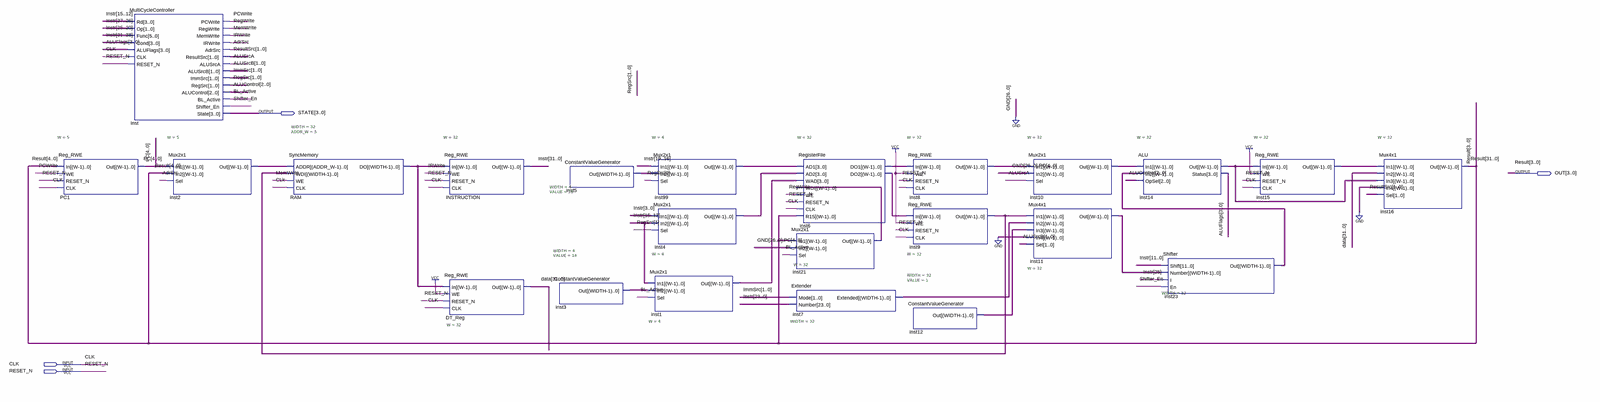
[diagram p0: schematic sheet, whole]
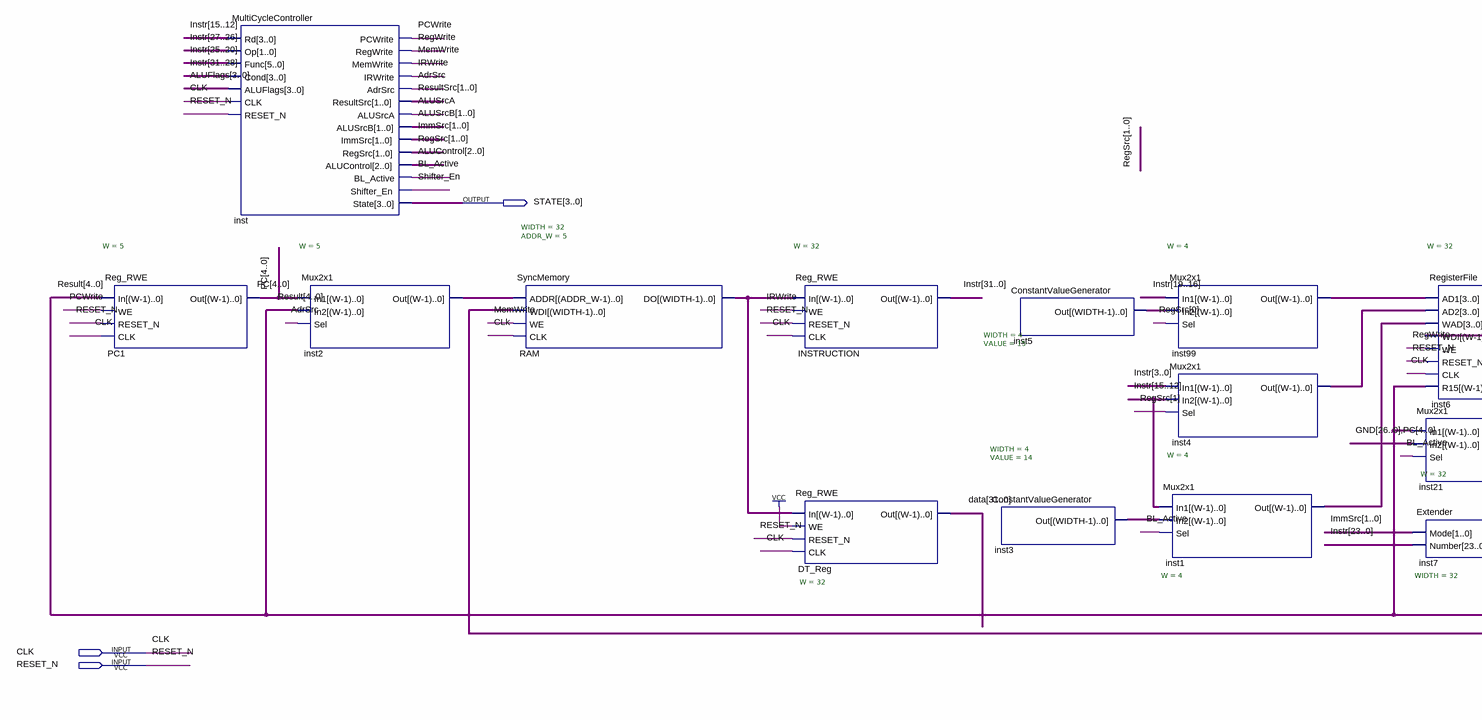
[diagram p1: schematic sheet, left part]
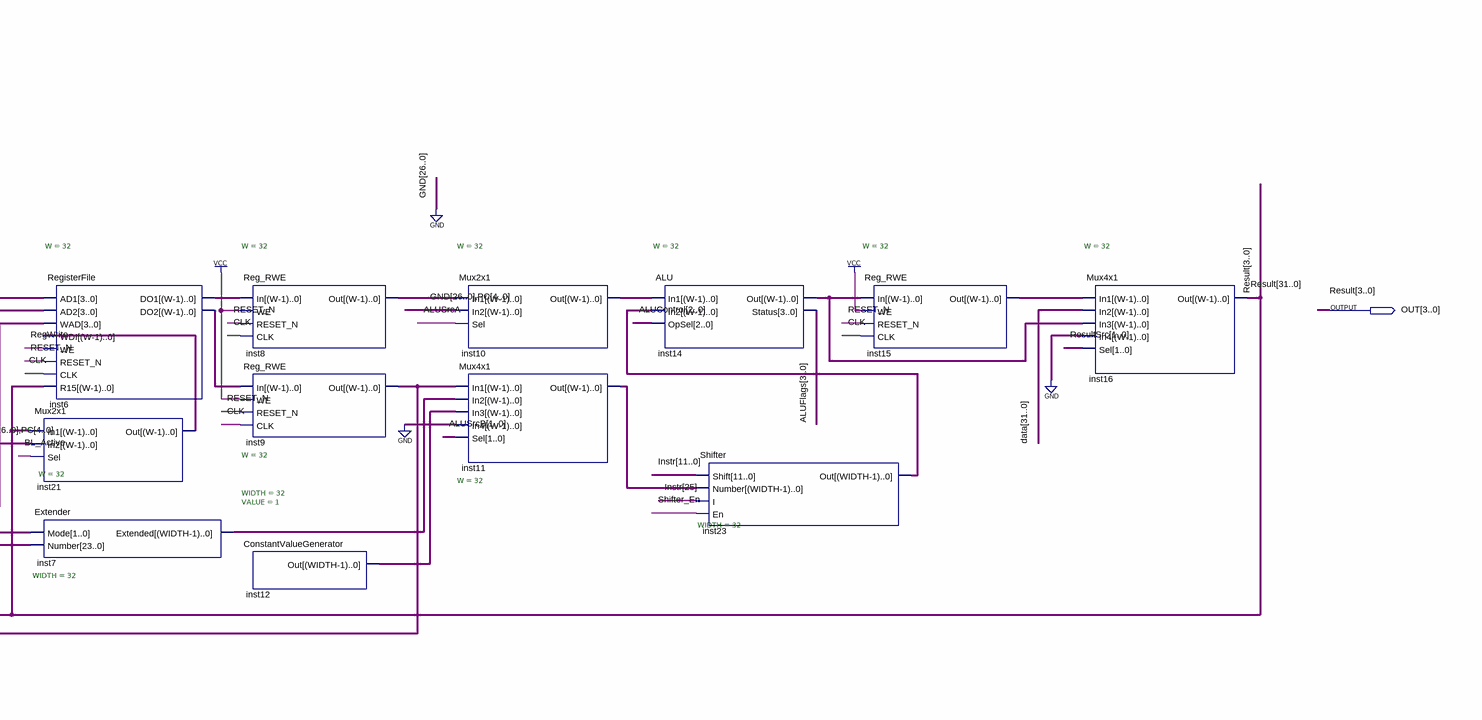
[diagram p2: schematic sheet, right part]
// Quartus schematic MultiCycle.bdf as structural Verilog: 23 symbols, 4 pins
module MultiCycle (
  input  CLK,
  input  RESET_N,
  output [3:0] STATE,
  output [3:0] OUT
);

  wire AdrSrc, ALUSrcA, BL_Active, IRWrite, MemWrite, PCWrite, RegWrite, Shifter_En;
  wire [1:0] ALUSrcB, ImmSrc, RegSrc, ResultSrc;
  wire [2:0] ALUControl;
  wire [3:0] ALUFlags, inst1_out, inst3_out, inst4_out, inst5_out, inst99_out;
  wire [4:0] inst2_out, PC;
  wire [31:0] data, inst6_do1, inst6_do2, inst7_extended, inst8_out, inst9_out, inst10_out, inst11_out,
       inst12_out, inst14_out, inst15_out, inst21_out, inst23_out, Instr, RAM_do;
  wire [31:4] Result;

  Reg_RWE #(.W(5)) PC1 (.In({Result[4], OUT}), .WE(PCWrite), .RESET_N(RESET_N), .CLK(CLK), .Out(PC));
  MultiCycleController inst (
    .Rd(Instr[15:12]), .Op(Instr[27:26]), .Func(Instr[25:20]), .Cond(Instr[31:28]), .ALUFlags(ALUFlags),
    .CLK(CLK), .RESET_N(RESET_N), .PCWrite(PCWrite), .RegWrite(RegWrite), .MemWrite(MemWrite),
    .IRWrite(IRWrite), .AdrSrc(AdrSrc), .ResultSrc(ResultSrc), .ALUSrcA(ALUSrcA), .ALUSrcB(ALUSrcB),
    .ImmSrc(ImmSrc), .RegSrc(RegSrc), .ALUControl(ALUControl), .BL_Active(BL_Active),
    .Shifter_En(Shifter_En), .State(STATE));
  Mux2x1 #(.W(5)) inst2 (.In1(PC), .In2({Result[4], OUT}), .Sel(AdrSrc), .Out(inst2_out));
  SyncMemory #(.WIDTH(32), .ADDR_W(5)) RAM (.ADDR(inst2_out), .WDI(inst9_out), .WE(MemWrite), .CLK(CLK), .DO(RAM_do));
  Reg_RWE #(.W(32)) INSTRUCTION (.In(RAM_do), .WE(IRWrite), .RESET_N(RESET_N), .CLK(CLK), .Out(Instr));
  Reg_RWE #(.W(32)) DT_Reg (.In(RAM_do), .WE(1'b1), .RESET_N(RESET_N), .CLK(CLK), .Out(data));
  ConstantValueGenerator #(.WIDTH(4), .VALUE(14)) inst3 (.Out(inst3_out));
  ConstantValueGenerator #(.WIDTH(4), .VALUE(15)) inst5 (.Out(inst5_out));
  Mux2x1 #(.W(4)) inst99 (.In1(Instr[19:16]), .In2(inst5_out), .Sel(RegSrc[0]), .Out(inst99_out));
  Mux2x1 #(.W(4)) inst4 (.In1(Instr[3:0]), .In2(Instr[15:12]), .Sel(RegSrc[1]), .Out(inst4_out));
  Mux2x1 #(.W(4)) inst1 (.In1(Instr[15:12]), .In2(inst3_out), .Sel(BL_Active), .Out(inst1_out));
  RegisterFile #(.W(32)) inst6 (
    .AD1(inst99_out), .AD2(inst4_out), .WAD(inst1_out), .WDI(inst21_out), .WE(RegWrite), .RESET_N(RESET_N),
    .CLK(CLK), .R15({Result, OUT}), .DO1(inst6_do1), .DO2(inst6_do2));
  Mux2x1 #(.W(32)) inst21 (.In1({Result, OUT}), .In2({{27{1'b0}}, PC}), .Sel(BL_Active), .Out(inst21_out));
  Extender #(.WIDTH(32)) inst7 (.Mode(ImmSrc), .Number(Instr[23:0]), .Extended(inst7_extended));
  Reg_RWE #(.W(32)) inst8 (.In(inst6_do1), .WE(1'b1), .RESET_N(RESET_N), .CLK(CLK), .Out(inst8_out));
  Reg_RWE #(.W(32)) inst9 (.In(inst6_do2), .WE(1'b1), .RESET_N(RESET_N), .CLK(CLK), .Out(inst9_out));
  ConstantValueGenerator #(.WIDTH(32), .VALUE(1)) inst12 (.Out(inst12_out));
  Mux2x1 #(.W(32)) inst10 (.In1(inst8_out), .In2({{27{1'b0}}, PC}), .Sel(ALUSrcA), .Out(inst10_out));
  Mux4x1 #(.W(32)) inst11 (
    .In1(inst9_out), .In2(inst7_extended), .In3(inst12_out), .In4({32{1'b0}}), .Sel(ALUSrcB), .Out(inst11_out));
  ALU #(.W(32)) inst14 (.In1(inst10_out), .In2(inst23_out), .OpSel(ALUControl), .Out(inst14_out), .Status(ALUFlags));
  Shifter #(.WIDTH(32)) inst23 (
    .Shift(Instr[11:0]), .Number(inst11_out), .I(Instr[25]), .En(Shifter_En), .Out(inst23_out));
  Reg_RWE #(.W(32)) inst15 (.In(inst14_out), .WE(1'b1), .RESET_N(RESET_N), .CLK(CLK), .Out(inst15_out));
  Mux4x1 #(.W(32)) inst16 (
    .In1(inst15_out), .In2(data), .In3(inst14_out), .In4({32{1'b0}}), .Sel(ResultSrc), .Out({Result, OUT}));

  // Other names for the same wires on the sheet: Result[3:0] = OUT
endmodule
